# Altium schematic sheet Block_Diagram.SchDoc
size A4; SheetNumber: 1; SheetTotal: 6
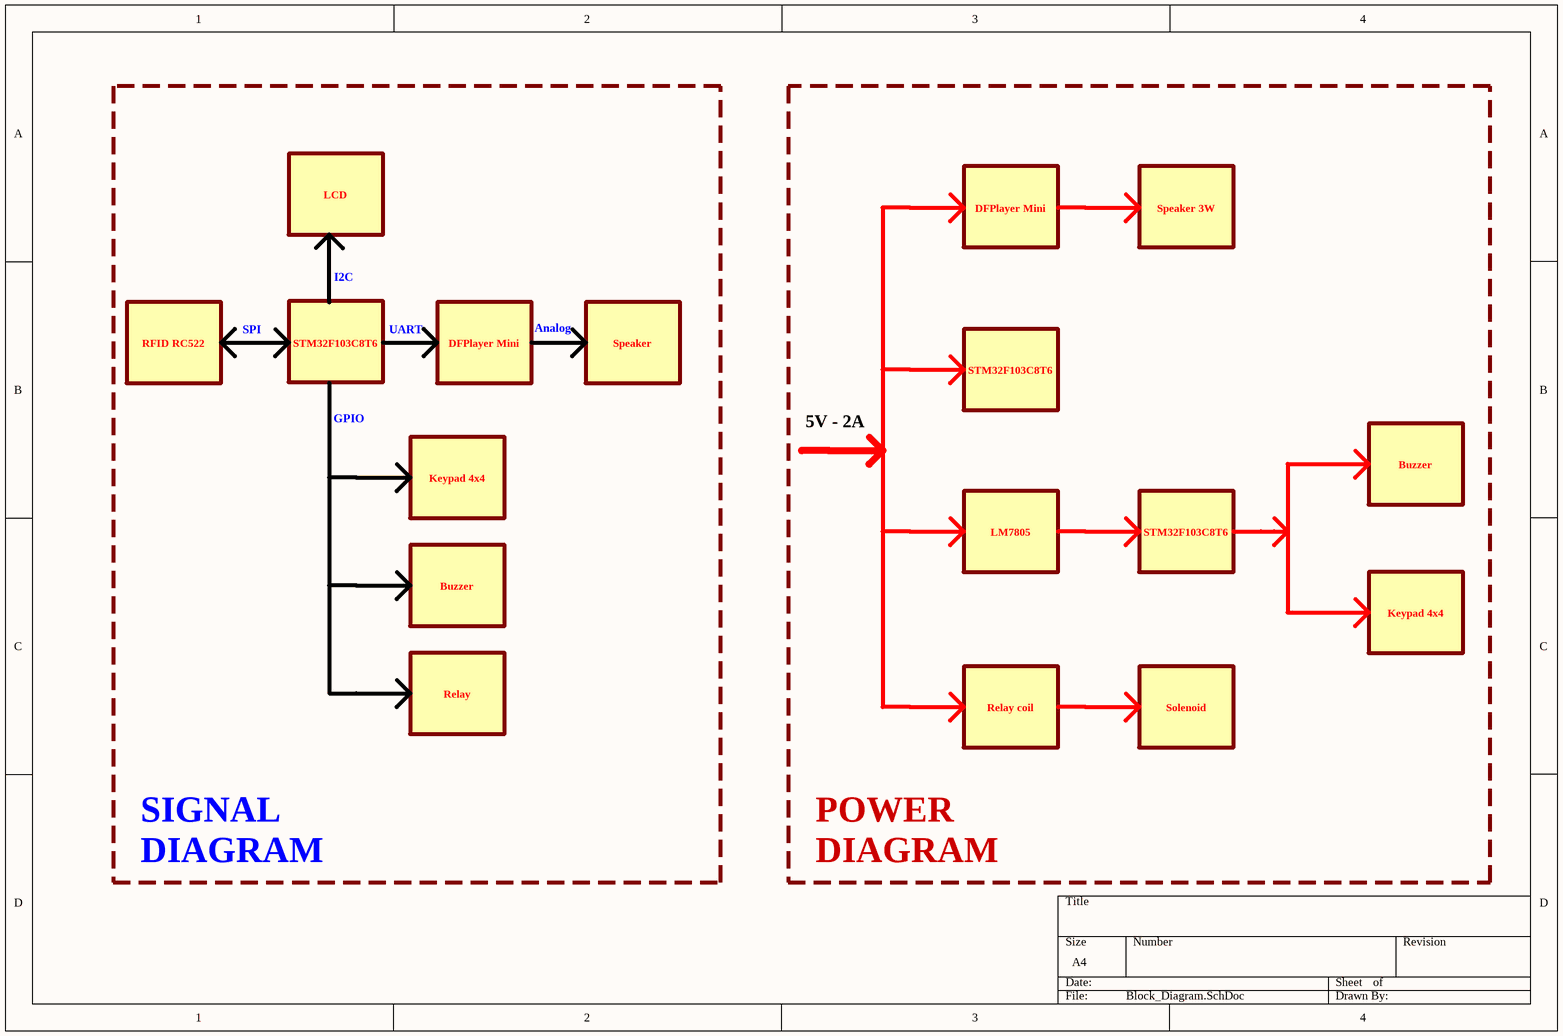
[diagram p0: Block_Diagram.SchDoc]

## Notes on the sheet
- LCD
- 620mA
- 5V
- DFPlayer Mini
- 600mA
- Speaker 3W
- I2C
- RFID RC522
- SPI
- STM32F103C8T6
- UART
- Analog
- Speaker
- GPIO
- 5V - 2A
- 30mA
- 3V3
- Keypad 4x4
- 2mA
- Buzzer
- 45mA
- LM7805
- 6mA
- Relay
- Relay coil
- Solenoid
- 1300mA
- 1000mA
- SIGNAL
  DIAGRAM
- POWER
  DIAGRAM